# Altium project 2014_MiniYaourtPhone.PRJPCB
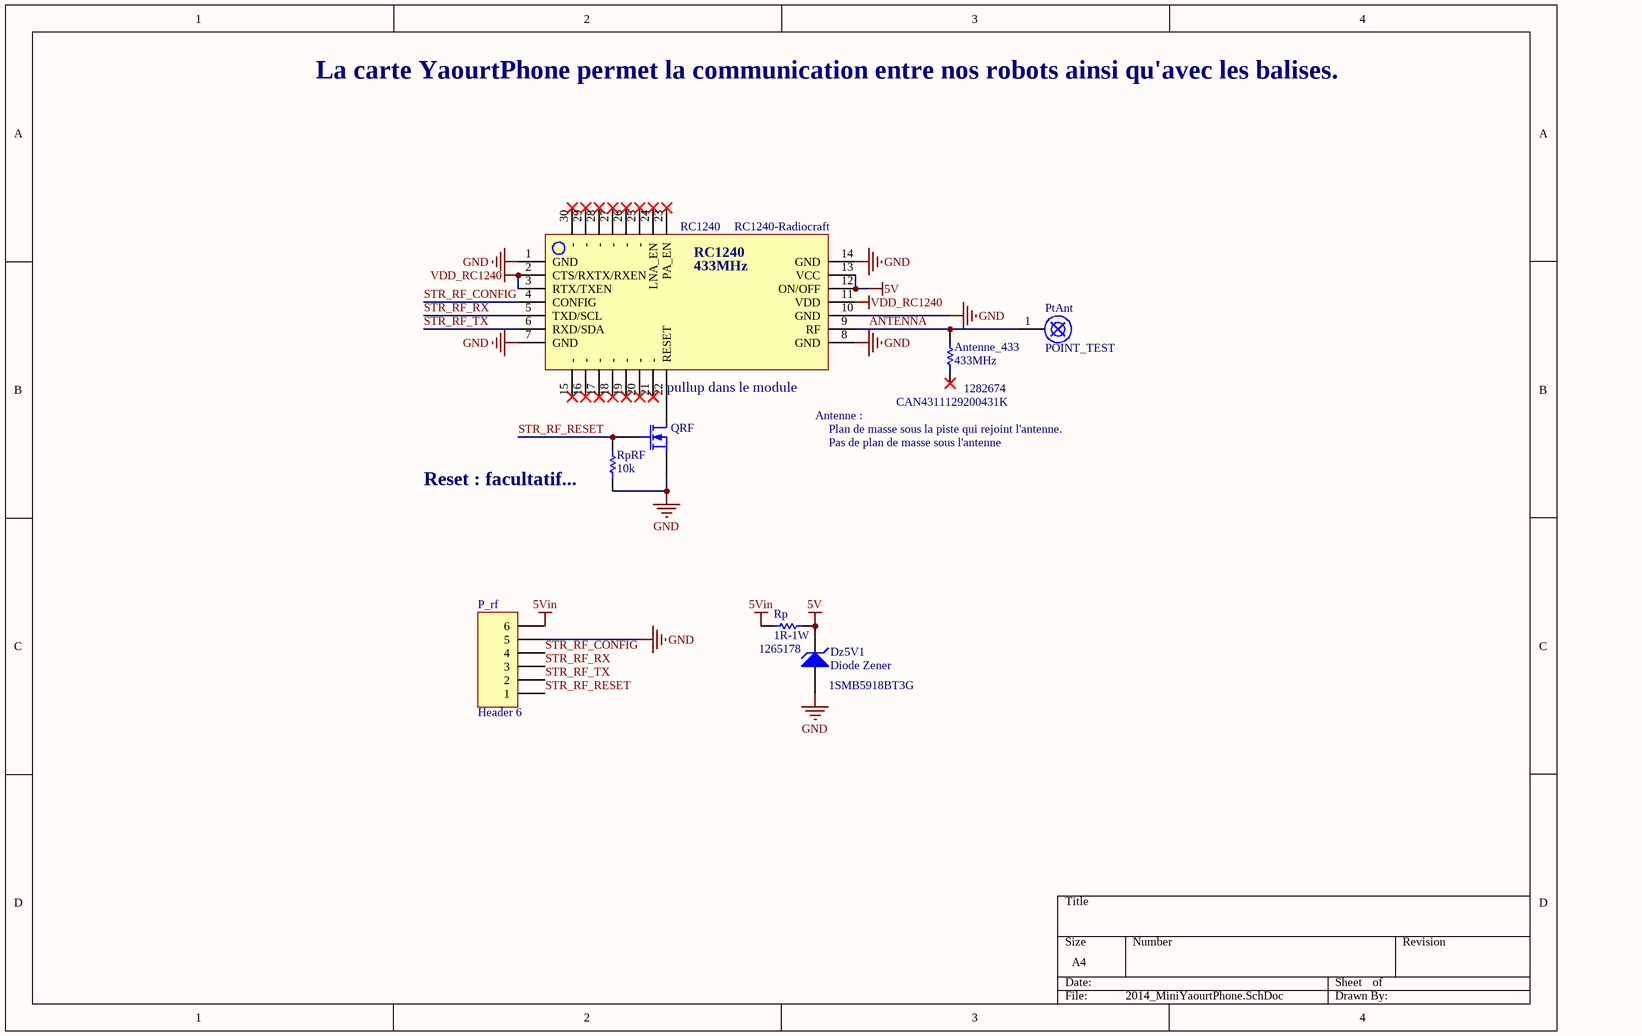
[diagram p0: 2014_MiniYaourtPhone.SchDoc]
1 sheet, 8 parts. Net scope: global (net labels, ports and power ports of the same name join across sheets).
Board file: 2014_MiniYaourtPhone.PCBDOC

## Sheet 2014_MiniYaourtPhone.SchDoc
size A4

### Parts
Antenne_433  433MHz  FAR: 1282674  [R1206_N]
Dz5V1  Diode Zener  [DIODE_CMS_SMB]
P_rf  Header 6  [HDR1X6]
PtAnt  POINT_TEST  [POINT_TEST]
QRF  Transistor MOSFET-N  [SOT23-3N]  (value not drawn)
RC1240  RC1240-Radiocraft  [RC1240]
Rp  1R-1W  FAR: 1265178  [INDUCTANCE_CMS_1812]
RpRF  10k  [R1206_N]

### Nets
5V: Dz5V1.2(K) RC1240.12(ON/OFF) RC1240.13(VCC) Rp.2
5Vin: P_rf.6 Rp.1
GND: Dz5V1.1(A) P_rf.5 QRF.2(S) RC1240.1(GND) RC1240.7(GND) RC1240.8(GND) RC1240.10(GND) RC1240.14(GND) RpRF.2
VDD_RC1240: RC1240.2(CTS/RXTX/RXEN) RC1240.3(RTX/TXEN) RC1240.11(VDD)
ANTENNA: Antenne_433.1 PtAnt.1 RC1240.9(RF)
STR_RF_CONFIG: P_rf.4 RC1240.4(CONFIG)
STR_RF_RESET: P_rf.1 QRF.1(G) RpRF.1
STR_RF_RX: P_rf.3 RC1240.5(TXD/SCL)
STR_RF_TX: P_rf.2 RC1240.6(RXD/SDA)
NetQRF_3: QRF.3(D) RC1240.22(RESET)

Not connected (* = marked no-connect by the designer): Antenne_433 2*; RC1240 15(-)* 16(-)* 17(-)* 18(-)* 19(-)* 20(-)* 21(-)* 23(PA_EN)* 24(LNA_EN)* 25(-)* 26(-)* 27(-)* 28(-)* 29(-)* 30(-)*

### Notes on the sheet
- La carte YaourtPhone permet la communication entre nos robots ainsi qu'avec les balises.
- (near RC1240) pullup dans le module
- (near RC1240) Antenne :
- Plan de masse sous la piste qui rejoint l'antenne.
- Pas de plan de masse sous l'antenne
- (near RpRF) Reset : facultatif...
- (in symbol Diode Zener) 1SMB5918BT3G
- (in symbol RC1240-Radiocraft) 433MHz

### Library data of the parts
Antenne_433 = Resistor: CAN4311129200431K; Published: 8-Jun-2000; LatestRevisionDate: 17-Jul-2002; LatestRevisionNote: Re-released for DXP Platform.; PackageReference: CAN4311129200431K; Publisher: Altium Limited
Dz5V1 = Diode Zener: Zener Diode
P_rf = Header 6: Header, 6-Pin; LatestRevisionDate: 17-Jul-2002; LatestRevisionNote: Re-released for DXP Platform.; Publisher: Altium Limited
PtAnt = POINT_TEST: POINT TEST
QRF = Transistor MOSFET-N: N-Channel MOSFET; PackageDocument: 1995/1996; Published: 8-Jun-2000; LatestRevisionDate: 17-Jul-2002; LatestRevisionNote: Re-released for DXP Platform.; PackageReference: E3; Publisher: Altium Limited
RC1240 = RC1240-Radiocraft: RC1240 - Radiocraft 433MHz Transceiver
Rp RpRF = Resistor: Published: 8-Jun-2000; LatestRevisionDate: 17-Jul-2002; LatestRevisionNote: Re-released for DXP Platform.; PackageReference: AXIAL-0.5; Publisher: Altium Limited